# EAGLE schematic sensorBoard (EAGLE 6.4)
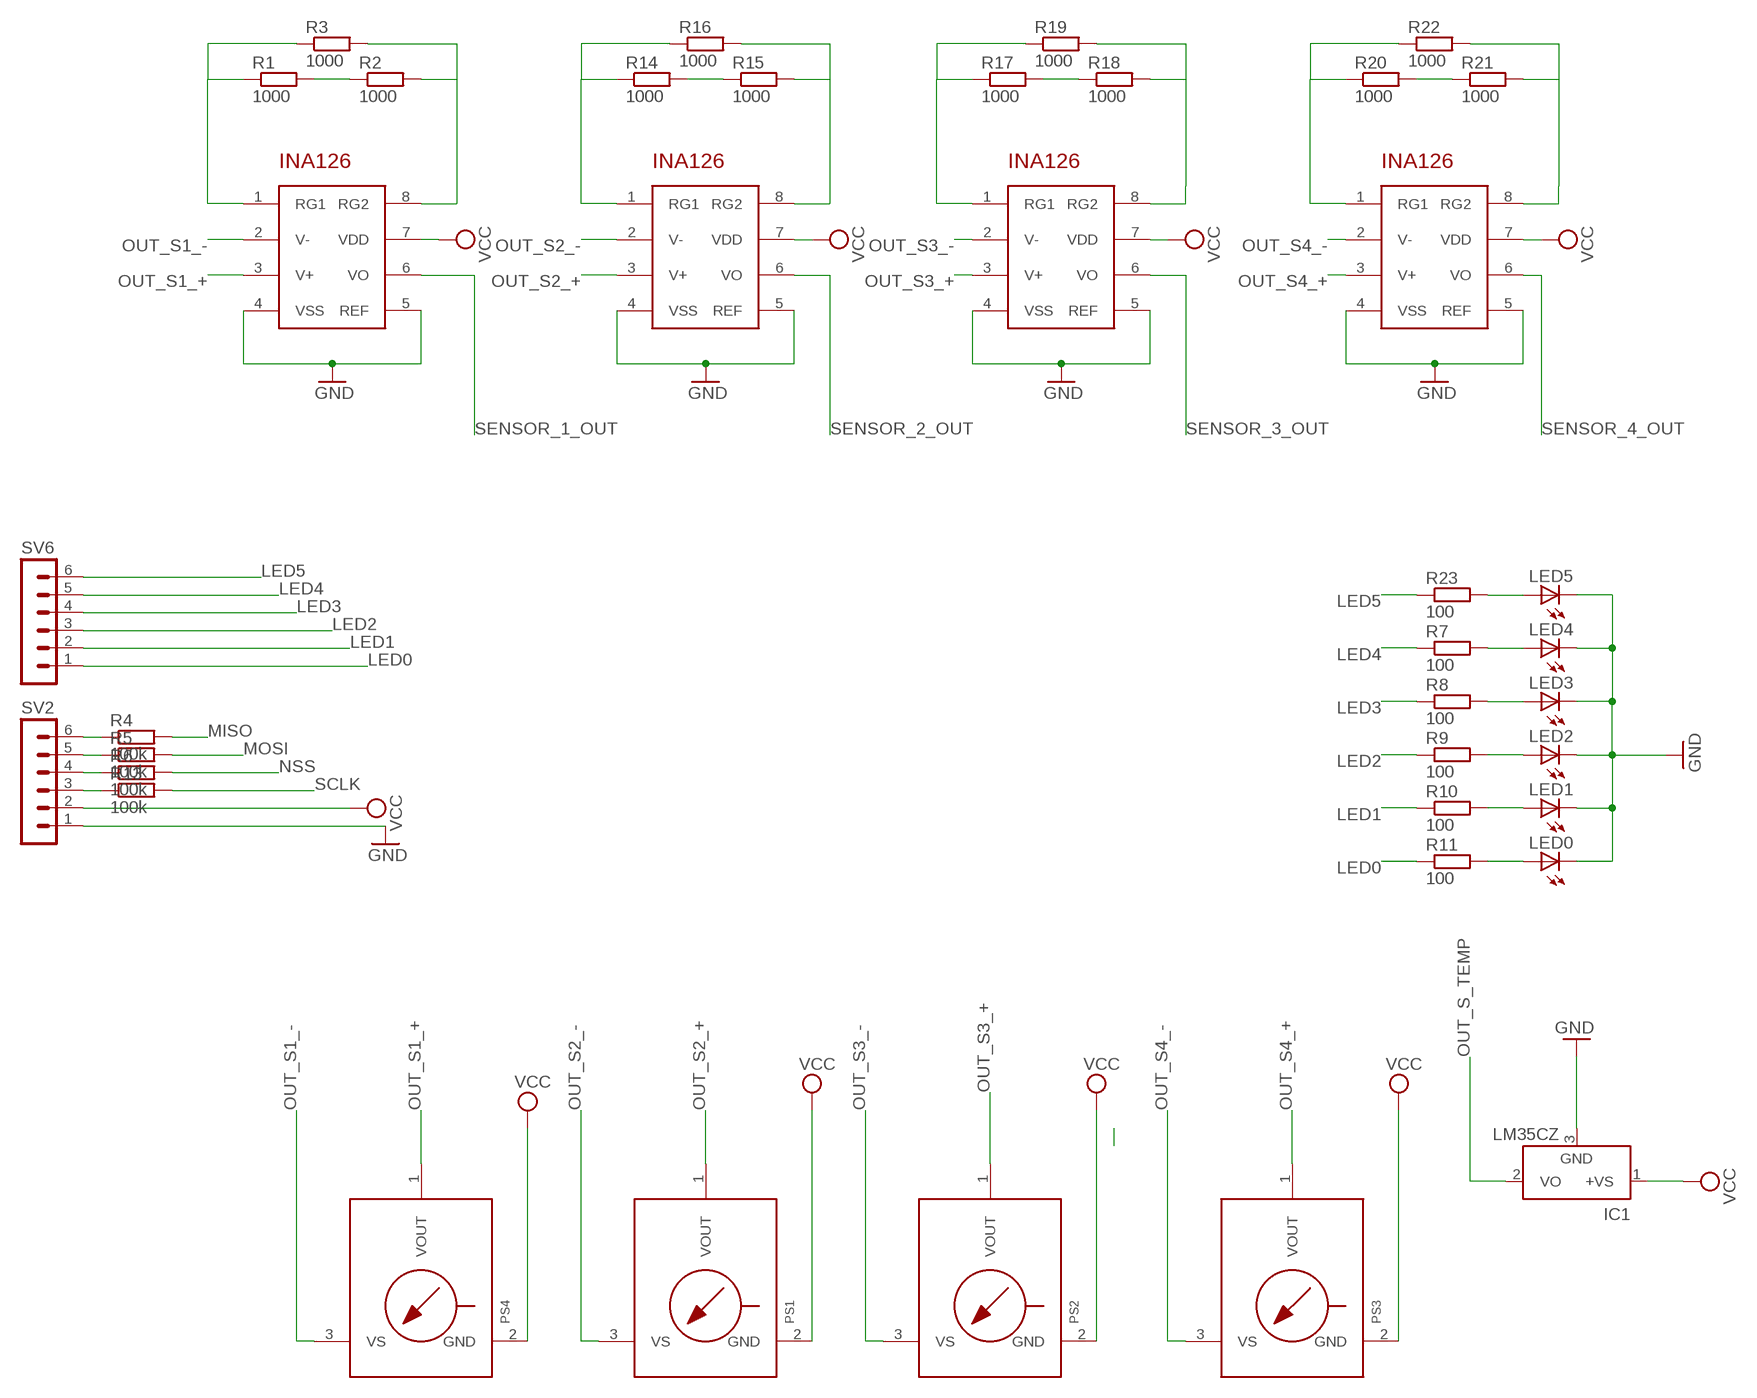
[diagram p0: schematic, sheet 1]

## Parts
IC1  LM35CZ  [TO92]
LED0  LED3MM  [LED3MM]
LED1  LED3MM  [LED3MM]
LED2  LED3MM  [LED3MM]
LED3  LED3MM  [LED3MM]
LED4  LED3MM  [LED3MM]
LED5  LED3MM  [LED3MM]
PS1  MPX-867B-H  [867B-H]
PS2  MPX-867B-H  [867B-H]
PS3  MPX-867B-H  [867B-H]
PS4  MPX-867B-H  [867B-H]
R1  1000  R-EU_R0603  [R0603]
R2  1000  R-EU_R0603  [R0603]
R3  1000  R-EU_R0603  [R0603]
R4  100k  R-EU_R0603  [R0603]
R5  100k  R-EU_R0603  [R0603]
R6  100k  R-EU_R0603  [R0603]
R7  100  R-EU_R0603  [R0603]
R8  100  R-EU_R0603  [R0603]
R9  100  R-EU_R0603  [R0603]
R10  100  R-EU_R0603  [R0603]
R11  100  R-EU_R0603  [R0603]
R13  100k  R-EU_R0603  [R0603]
R14  1000  R-EU_R0603  [R0603]
R15  1000  R-EU_R0603  [R0603]
R16  1000  R-EU_R0603  [R0603]
R17  1000  R-EU_R0603  [R0603]
R18  1000  R-EU_R0603  [R0603]
R19  1000  R-EU_R0603  [R0603]
R20  1000  R-EU_R0603  [R0603]
R21  1000  R-EU_R0603  [R0603]
R22  1000  R-EU_R0603  [R0603]
R23  100  R-EU_R0603  [R0603]
SV2  MA06-1  [MA06-1]
SV6  MA06-1  [MA06-1]
U$1  INA126  [SO-08]
U$2  INA126  [SO-08]
U$3  INA126  [SO-08]
U$4  INA126  [SO-08]

## Nets
GND: IC1.3(GND) LED0.K(C) LED1.K(C) LED2.K(C) LED3.K(C) LED4.K(C) LED5.K(C) SV2.1 U$1.4(VSS) U$1.5(REF) U$2.4(VSS) U$2.5(REF) U$3.4(VSS) U$3.5(REF) U$4.4(VSS) U$4.5(REF)
LED0: R11.1 SV6.1
LED1: R10.1 SV6.2
LED2: R9.1 SV6.3
LED3: R8.1 SV6.4
LED4: R7.1 SV6.5
LED5: R23.1 SV6.6
MISO: R4.1 R4.2 SV2.6
MOSI: R5.1 R5.2 SV2.5
N$1: R2.2 R3.2 U$4.8(RG2)
N$2: R1.1 R3.1 U$4.1(RG1)
N$3: U$1.2(V-)
N$4: U$1.3(V+)
N$5: U$1.1(RG1)
N$6: LED5.A R23.2
N$7: R15.2 R16.2 U$1.8(RG2)
N$8: R1.2 R2.1
N$10: R14.1 R16.1
N$11: R14.2 R15.1
N$12: U$2.2(V-)
N$13: U$2.3(V+)
N$16: U$4.2(V-)
N$17: LED4.A R7.2
N$18: U$4.3(V+)
N$19: R17.1 R19.1 U$2.1(RG1)
N$20: LED3.A R8.2
N$21: LED2.A R9.2
N$22: LED1.A R10.2
N$23: LED0.A R11.2
N$24: R18.2 R19.2 U$2.8(RG2)
N$26: R20.1 R22.1 U$3.1(RG1)
N$27: R21.2 R22.2 U$3.8(RG2)
N$28: U$3.2(V-)
N$29: U$3.3(V+)
N$30: R17.2 R18.1
N$35: R20.2 R21.1
NSS: R6.1 R6.2 SV2.4
OUT_S1_+: PS4.1(VOUT)
OUT_S1_-: PS4.3(VS)
OUT_S2_+: PS1.1(VOUT)
OUT_S2_-: PS1.3(VS)
OUT_S3_+: PS2.1(VOUT)
OUT_S3_-: PS2.3(VS)
OUT_S4_+: PS3.1(VOUT)
OUT_S4_-: PS3.3(VS)
OUT_S_TEMP: IC1.2(VO)
SCLK: R13.1 R13.2 SV2.3
SENSOR_1_OUT: U$4.6(VO)
SENSOR_2_OUT: U$1.6(VO)
SENSOR_3_OUT: U$2.6(VO)
SENSOR_4_OUT: U$3.6(VO)
VCC: IC1.1(+VS) PS1.2(GND) PS2.2(GND) PS3.2(GND) PS4.2(GND) SV2.2 U$1.7(VDD) U$2.7(VDD) U$3.7(VDD) U$4.7(VDD)
Unconnected: PS1.4(NC) PS1.5(NC) PS1.6(NC) PS2.4(NC) PS2.5(NC) PS2.6(NC) PS3.4(NC) PS3.5(NC) PS3.6(NC) PS4.4(NC) PS4.5(NC) PS4.6(NC)

## Library data of the parts
IC1 = lm35:LM35: Single-Supply Centigrade Temperature Sensor Vout = (10mV/°C x Temp °C) +5mmmV Source: http://www.national.com/ds/LM/LM35.pdf
LED0 LED1-LED5 = led:LED: LED OSRAM: - CHIPLED LG R971, LG N971, LY N971, LG Q971, LY Q971, LO R971, LY R971 LH N974, LH R974 LS Q976, LO Q976, LY Q976 LO Q996 - Hyper CHIPLED LW Q18S LB Q993, LB Q99A, LB R99A - SideLED LS A670, LO A670, LY A670, LG A670, LP A670 LB A673, LV A673, LT A673, LW A673 LH A674 LY A675 LS A676, LA A676, LO A676, LY A676, LW A676 LS A679, LY A679, LG A679 - Hyper Micro SIDELED® LS Y876, LA Y876, LO Y876, LY Y876 LT Y87S - SmartLED LW L88C, LW L88S LB L89C, LB L89S, LG L890 LS L89K, LO L89K, LY L89K LS L896, LA L896, LO L896, LY L896 - TOPLED LS T670, LO T670, LY T670, LG T670, LP T670 LSG T670, LSP T670, LSY T670, LOP T670, LYG T670 LG T671, LOG T671, LSG T671 LB T673, LV T673, LT T673, LW T673 LH T674 LS T676, LA T676, LO T676, LY T676, LB T676, LH T676, LSB T676, LW T676 LB T67C, LV T67C, LT T67C, LS T67K, LO T67K, LY T67K, LW E67C LS E67B, LA E67B, LO E67B, LY E67B, LB E67C, LV E67C, LT E67C LW T67C LS T679, LY T679, LG T679 LS T770, LO T770, LY T770, LG T770, LP T770 LB T773, LV T773, LT T773, LW T773 LH T774 LS E675, LA E675, LY E675, LS T675 LS T776, LA T776, LO T776, LY T776, LB T776 LHGB T686 LT T68C, LB T68C - Hyper Mini TOPLED® LB M676 - Mini TOPLED Santana® LG M470 LS M47K, LO M47K, LY M47K Source: http://www.osram.convergy.de LUXEON: - LUMILED® LXK2-PW12-R00, LXK2-PW12-S00, LXK2-PW14-U00, LXK2-PW14-V00 LXK2-PM12-R00, LXK2-PM12-S00, LXK2-PM14-U00 LXK2-PE12-Q00, LXK2-PE12-R00, LXK2-PE12-S00, LXK2-PE14-T00, LXK2-PE14-U00 LXK2-PB12-K00, LXK2-PB12-L00, LXK2-PB12-M00, LXK2-PB14-N00, LXK2-PB14-P00, LXK2-PB14-Q00 LXK2-PR12-L00, LXK2-PR12-M00, LXK2-PR14-Q00, LXK2-PR14-R00 LXK2-PD12-Q00, LXK2-PD12-R00, LXK2-PD12-S00 LXK2-PH12-R00, LXK2-PH12-S00 LXK2-PL12-P00, LXK2-PL12-Q00, LXK2-PL12-R00 Source: www.luxeon.com KINGBRIGHT: KA-3528ASYC Source: www.kingbright.com
PS1-PS4 = mpx-freescale:MPX*****: Generic MPX pressure sensor
R1-R11 R13-R23 = rcl:R-EU_: RESISTOR, European symbol
SV2 SV6 = con-lstb:MA06-1: PIN HEADER; OC_FARNELL: unknown; OC_NEWARK: unknown
U$1-U$4 = 0SBLib:INA126